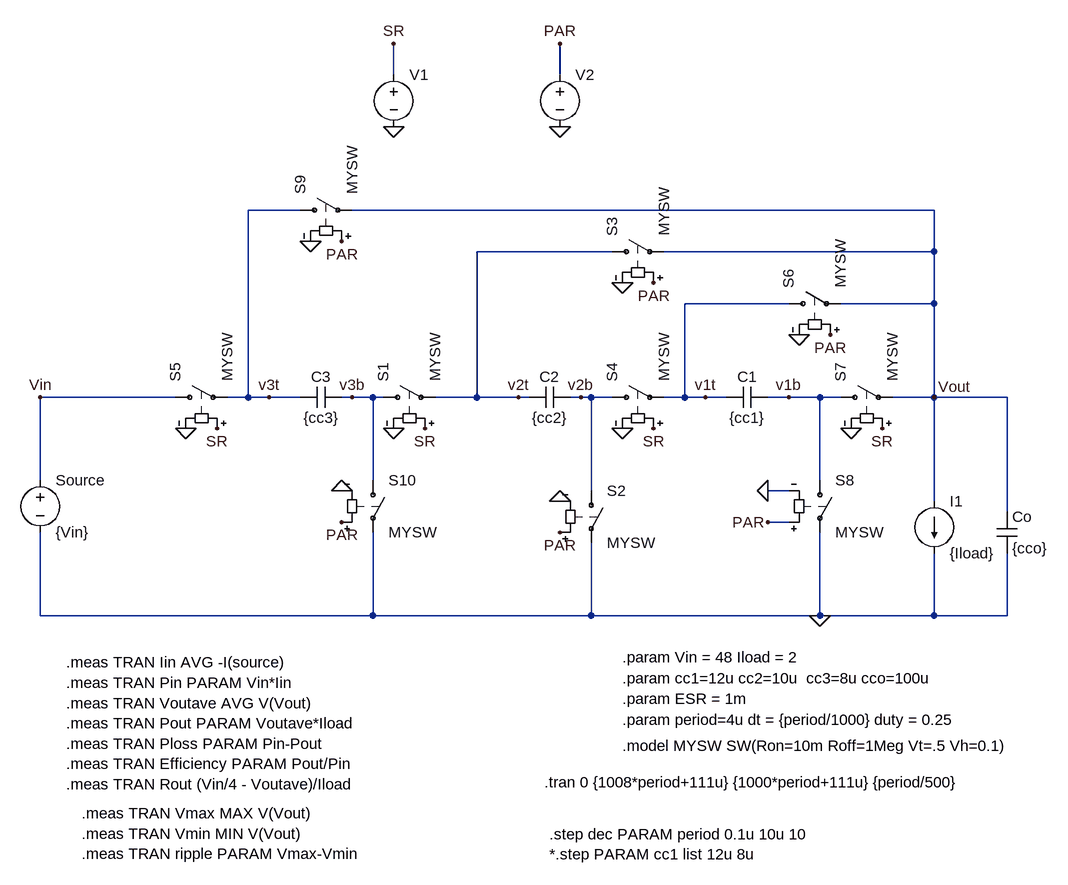
[diagram p0: schematic 4to1_hard_charging.asc]
4to1_hard_charging.asc, the LTspice schematic file:
Version 4
SHEET 1 2036 1112
WIRE -240 -480 -240 -528
WIRE 16 -480 16 -528
WIRE -384 -272 -464 -272
WIRE 592 -272 -304 -272
WIRE 96 -208 -112 -208
WIRE 592 -208 592 -272
WIRE 592 -208 176 -208
WIRE 368 -128 208 -128
WIRE 592 -128 592 -208
WIRE 592 -128 448 -128
WIRE -576 16 -784 16
WIRE -464 16 -464 -272
WIRE -464 16 -496 16
WIRE -432 16 -464 16
WIRE -384 16 -432 16
WIRE -304 16 -320 16
WIRE -272 16 -304 16
WIRE -256 16 -272 16
WIRE -112 16 -112 -208
WIRE -112 16 -176 16
WIRE -48 16 -112 16
WIRE -32 16 -48 16
WIRE 48 16 32 16
WIRE 64 16 48 16
WIRE 96 16 64 16
WIRE 208 16 208 -128
WIRE 208 16 176 16
WIRE 240 16 208 16
WIRE 272 16 240 16
WIRE 368 16 336 16
WIRE 416 16 368 16
WIRE 448 16 416 16
WIRE 592 16 592 -128
WIRE 592 16 528 16
WIRE 704 16 592 16
WIRE -784 144 -784 16
WIRE -272 144 -272 16
WIRE 416 144 416 16
WIRE 64 160 64 16
WIRE 368 160 336 160
WIRE 592 176 592 16
WIRE 704 192 704 16
WIRE 368 208 336 208
WIRE -784 352 -784 224
WIRE -272 352 -272 224
WIRE -272 352 -784 352
WIRE 64 352 64 240
WIRE 64 352 -272 352
WIRE 416 352 416 224
WIRE 416 352 64 352
WIRE 592 352 592 256
WIRE 592 352 416 352
WIRE 704 352 704 256
WIRE 704 352 592 352
FLAG 16 -400 0
FLAG 16 -528 PAR
FLAG 416 352 0
FLAG 112 64 0
FLAG 464 64 0
FLAG 336 160 0
FLAG 384 -80 0
FLAG 432 -80 PAR
FLAG 336 208 PAR
FLAG 160 64 SR
FLAG 512 64 SR
FLAG -784 16 Vin
FLAG -48 16 v2t
FLAG 240 16 v1t
FLAG 592 16 Vout
FLAG -192 64 SR
FLAG 160 -160 PAR
FLAG 16 224 PAR
FLAG -240 64 0
FLAG 112 -160 0
FLAG 16 176 0
FLAG 48 16 v2b
FLAG -320 -224 PAR
FLAG -368 -224 0
FLAG -560 64 0
FLAG -512 64 SR
FLAG -320 208 PAR
FLAG -320 160 0
FLAG -432 16 v3t
FLAG -304 16 v3b
FLAG 368 16 v1b
FLAG -240 -400 0
FLAG -240 -528 SR
SYMBOL voltage 16 -496 R0
WINDOW 123 0 0 Left 2
WINDOW 39 0 0 Left 2
WINDOW 3 24 96 Invisible 2
SYMATTR InstName V2
SYMATTR Value PULSE(0 1 {period*duty} 1p 1p {period*(1-duty)-dt} {period})
SYMBOL voltage -784 128 R0
WINDOW 123 0 0 Left 2
WINDOW 39 0 0 Left 2
SYMATTR InstName Source
SYMATTR Value {Vin}
SYMBOL cap 272 32 R270
WINDOW 0 32 32 VTop 2
WINDOW 3 0 32 VBottom 2
SYMATTR InstName C1
SYMATTR Value {cc1}
SYMATTR SpiceLine Rser = {ESR} ic = {Vin/4}
SYMBOL sw 80 16 R270
SYMATTR InstName S4
SYMATTR Value MYSW
SYMBOL sw 352 -128 R270
SYMATTR InstName S6
SYMATTR Value MYSW
SYMBOL sw 432 16 R270
SYMATTR InstName S7
SYMATTR Value MYSW
SYMBOL sw 416 128 R0
SYMATTR InstName S8
SYMATTR Value MYSW
SYMBOL cap 688 192 R0
SYMATTR InstName Co
SYMATTR Value {cco}
SYMATTR Value2 Rser = {ESR} ic = {Vin/4}
SYMBOL cap -32 32 R270
WINDOW 0 32 32 VTop 2
WINDOW 3 0 32 VBottom 2
SYMATTR InstName C2
SYMATTR Value {cc2}
SYMATTR SpiceLine Rser = {ESR} ic = {Vin/4}
SYMBOL sw 64 144 R0
SYMATTR InstName S2
SYMATTR Value MYSW
SYMBOL sw 80 -208 R270
SYMATTR InstName S3
SYMATTR Value MYSW
SYMBOL sw -272 16 R270
SYMATTR InstName S1
SYMATTR Value MYSW
SYMBOL sw -592 16 R270
SYMATTR InstName S5
SYMATTR Value MYSW
SYMBOL cap -384 32 R270
WINDOW 0 32 32 VTop 2
WINDOW 3 0 32 VBottom 2
SYMATTR InstName C3
SYMATTR Value {cc3}
SYMATTR SpiceLine Rser = {ESR} ic = {Vin/4}
SYMBOL sw -400 -272 R270
SYMATTR InstName S9
SYMATTR Value MYSW
SYMBOL sw -272 128 R0
SYMATTR InstName S10
SYMATTR Value MYSW
SYMBOL current 592 176 R0
SYMATTR InstName I1
SYMATTR Value {Iload}
SYMBOL voltage -240 -496 R0
WINDOW 123 0 0 Left 2
WINDOW 39 0 0 Left 2
WINDOW 3 24 96 Invisible 2
SYMATTR InstName V1
SYMATTR Value PULSE(0 1 0 1p 1p {period*duty-dt} {period})
TEXT -8 608 Left 2 !.tran 0 {1008*period+111u} {1000*period+111u} {period/500}
TEXT 112 552 Left 2 !.model MYSW SW(Ron=10m Roff=1Meg Vt=.5 Vh=0.1)
TEXT -744 424 Left 2 !.meas TRAN Iin AVG -I(source)\n.meas TRAN Pin PARAM Vin*Iin\n.meas TRAN Voutave AVG V(Vout)\n.meas TRAN Pout PARAM Voutave*Iload\n.meas TRAN Ploss PARAM Pin-Pout\n.meas TRAN Efficiency PARAM Pout/Pin\n.meas TRAN Rout (Vin/4 - Voutave)/Iload
TEXT 112 448 Left 2 !.param cc1=12u cc2=10u  cc3=8u cco=100u
TEXT 0 688 Left 2 !.step dec PARAM period 0.1u 10u 10\n*.step PARAM cc1 list 12u 8u
TEXT -720 656 Left 2 !.meas TRAN Vmax MAX V(Vout)\n.meas TRAN Vmin MIN V(Vout)\n.meas TRAN ripple PARAM Vmax-Vmin
TEXT 112 416 Left 2 !.param Vin = 48 Iload = 2
TEXT 112 512 Left 2 !.param period=4u dt = {period/1000} duty = 0.25
TEXT 112 480 Left 2 !.param ESR = 1m

The netlist it stands for:
* 4to1_hard_charging.asc
V2 PAR 0 PULSE(0 1 {period*duty} 1p 1p {period*(1-duty)-dt} {period})
V§Source Vin 0 {Vin}
C1 v1t v1b {cc1} Rser = {ESR} ic = {Vin/4}
S4 v2b v1t SR 0 MYSW
S6 v1t Vout PAR 0 MYSW
S7 v1b Vout SR 0 MYSW
S8 v1b 0 PAR 0 MYSW
Co Vout 0 {cco} Rser = {ESR} ic = {Vin/4}
C2 v2t v2b {cc2} Rser = {ESR} ic = {Vin/4}
S2 v2b 0 PAR 0 MYSW
S3 v2t Vout PAR 0 MYSW
S1 v3b v2t SR 0 MYSW
S5 Vin v3t SR 0 MYSW
C3 v3t v3b {cc3} Rser = {ESR} ic = {Vin/4}
S9 v3t Vout PAR 0 MYSW
S10 v3b 0 PAR 0 MYSW
I1 Vout 0 {Iload}
V1 SR 0 PULSE(0 1 0 1p 1p {period*duty-dt} {period})
.tran 0 {1008*period+111u} {1000*period+111u} {period/500}
.model MYSW SW(Ron=10m Roff=1Meg Vt=.5 Vh=0.1)
.meas TRAN Iin AVG -I(source)
.meas TRAN Pin PARAM Vin*Iin
.meas TRAN Voutave AVG V(Vout)
.meas TRAN Pout PARAM Voutave*Iload
.meas TRAN Ploss PARAM Pin-Pout
.meas TRAN Efficiency PARAM Pout/Pin
.meas TRAN Rout (Vin/4 - Voutave)/Iload
.param cc1=12u cc2=10u  cc3=8u cco=100u
.step dec PARAM period 0.1u 10u 10
*.step PARAM cc1 list 12u 8u
.meas TRAN Vmax MAX V(Vout)
.meas TRAN Vmin MIN V(Vout)
.meas TRAN ripple PARAM Vmax-Vmin
.param Vin = 48 Iload = 2
.param period=4u dt = {period/1000} duty = 0.25
.param ESR = 1m
.backanno
.end